# EAGLE design at88g.v1 (EAGLE 4.11)
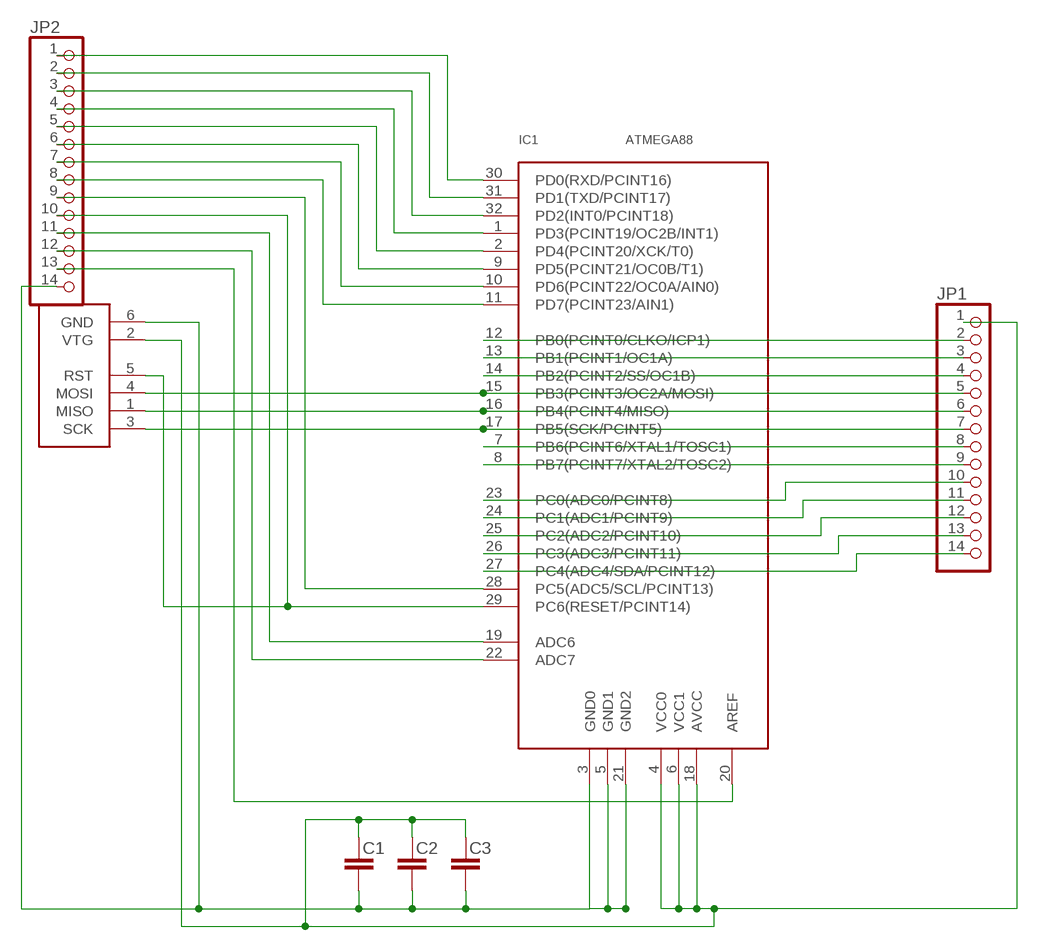
[diagram p0: schematic, sheet 1]

## Parts
C1  C-EU  [C0603]
C2  C-EU  [C0603]
C3  C-EU  [C0603]
IC1  ATMEGA88  [TQFP32]
JP1  PINHD-1X14  [1X14]
JP2  PINHD-1X14  [1X14]
X1  AVRISP6PIN  [6PIN]

## Nets
GND0: C1.2 C2.2 C3.2 IC1.3(GND0) IC1.5(GND1) IC1.21(GND2) JP2.14 X1.6(GND)
N$1: IC1.29(PC6(RESET/PCINT14)) JP2.10 X1.5(RST)
N$2: IC1.15(PB3(PCINT3/OC2A/MOSI)) JP1.5 X1.4(MOSI)
N$3: IC1.16(PB4(PCINT4/MISO)) JP1.6 X1.1(MISO)
N$4: IC1.17(PB5(SCK/PCINT5)) JP1.7 X1.3(SCK)
N$5: IC1.30(PD0(RXD/PCINT16)) JP2.1
N$6: IC1.31(PD1(TXD/PCINT17)) JP2.2
N$7: IC1.32(PD2(INT0/PCINT18)) JP2.3
N$8: IC1.1(PD3(PCINT19/OC2B/INT1)) JP2.4
N$9: IC1.2(PD4(PCINT20/XCK/T0)) JP2.5
N$10: IC1.9(PD5(PCINT21/OC0B/T1)) JP2.6
N$11: IC1.10(PD6(PCINT22/OC0A/AIN0)) JP2.7
N$12: IC1.11(PD7(PCINT23/AIN1)) JP2.8
N$13: IC1.12(PB0(PCINT0/CLKO/ICP1)) JP1.2
N$14: IC1.13(PB1(PCINT1/OC1A)) JP1.3
N$15: IC1.14(PB2(PCINT2/SS/OC1B)) JP1.4
N$16: IC1.7(PB6(PCINT6/XTAL1/TOSC1)) JP1.8
N$17: IC1.8(PB7(PCINT7/XTAL2/TOSC2)) JP1.9
N$18: IC1.23(PC0(ADC0/PCINT8)) JP1.10
N$19: IC1.24(PC1(ADC1/PCINT9)) JP1.11
N$20: IC1.25(PC2(ADC2/PCINT10)) JP1.12
N$21: IC1.26(PC3(ADC3/PCINT11)) JP1.13
N$22: IC1.27(PC4(ADC4/SDA/PCINT12)) JP1.14
N$23: IC1.28(PC5(ADC5/SCL/PCINT13)) JP2.9
N$24: IC1.19(ADC6) JP2.11
N$25: IC1.22(ADC7) JP2.12
N$26: IC1.20(AREF) JP2.13
VCC0: C1.1 C2.1 C3.1 IC1.4(VCC0) IC1.6(VCC1) IC1.18(AVCC) JP1.1 X1.2(VTG)

## Library data of the parts
C1-C3 = rcl:C-EU
IC1 = atmega88:ATMEGA88
JP1 JP2 = pinhead-mm:PINHD-1X14
X1 = avrisp:AVRISP6PIN

## Board
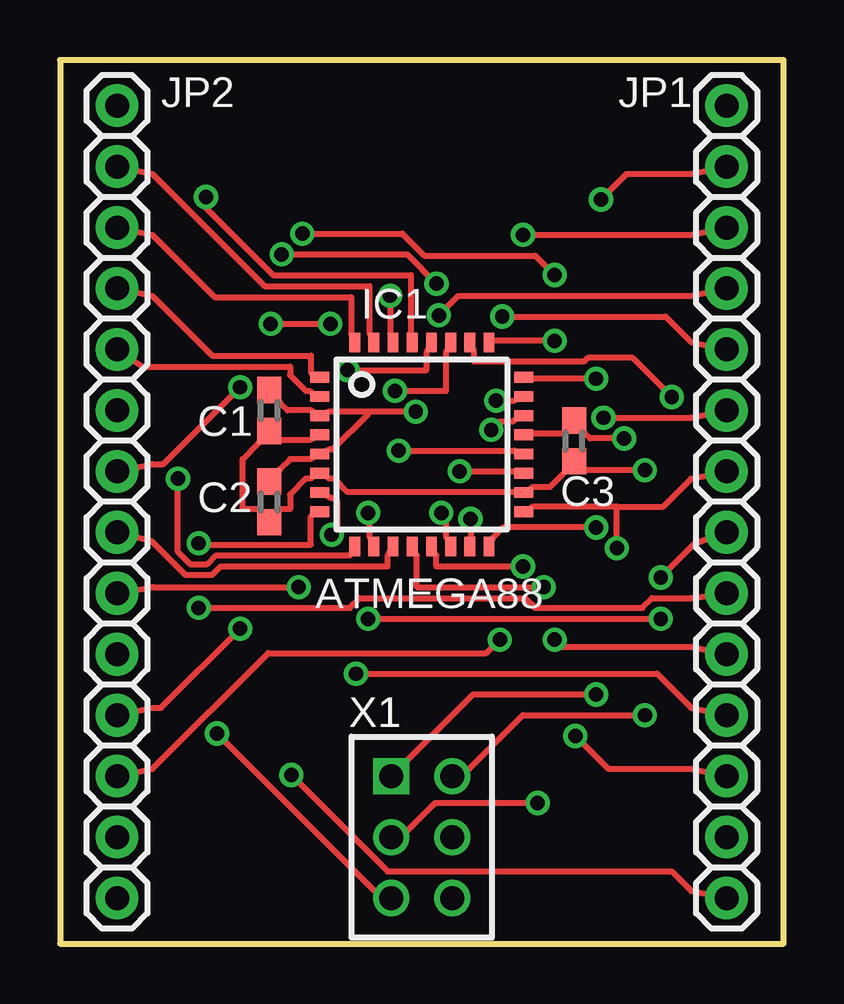
[diagram p1: board, top side]
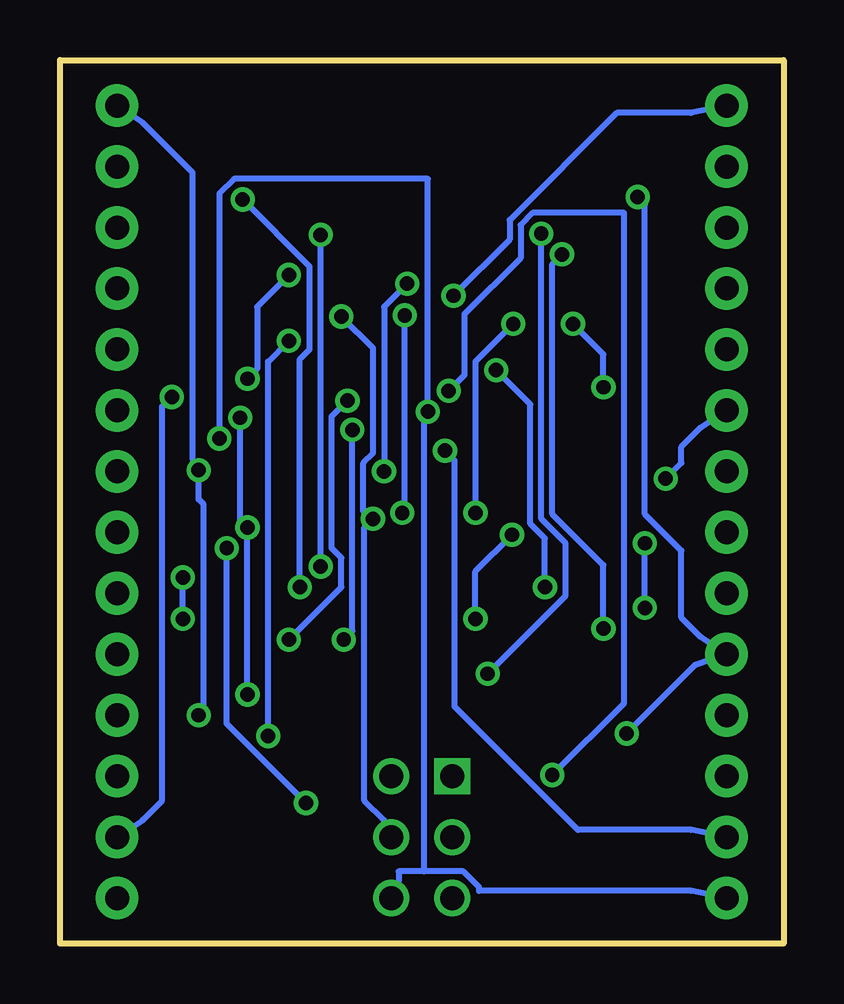
[diagram p2: board, bottom side, seen from below]

Size 30.15 x 36.82 mm. Coordinates in mm from the lower left corner, seen from the top.
Outline: 0,0 30.15,0 30.15,36.82 0,36.82 0,0
Copper layers (1*16): Top 0.035mm / dielectric 1.5mm / Bottom 0.035mm
Design rules "default": minimum track width 10mil, minimum drill 0.6mm, track to track 8mil, track to pad 8mil, pad to pad 8mil, via to via 8mil, smd to smd 8mil, copper to edge 40mil, drill to drill 8mil, minimum pad ring 10mil, minimum via ring 8mil, stop-mask expansion 4mil, vias tented up to drill 0mil, thermal gap 10mil

### Footprints (pad centres in the part's own frame; a part is rotated, then mirrored left to right if it is on the bottom)
C0603 = smd 1.1 x 1: 1 -0.85,0; 2 0.85,0
TQFP32 = smd 0.8 x 0.45: 1 -4.25,2.65; 2 -4.25,1.85; 3 -4.25,1.05; 4 -4.25,0.25; 5 -4.25,-0.55; 6 -4.25,-1.35; 7 -4.25,-2.15; 8 -4.25,-2.95; 17 4.25,-2.95; 18 4.25,-2.15; 19 4.25,-1.35; 20 4.25,-0.55; 21 4.25,0.25; 22 4.25,1.05; 23 4.25,1.85; 24 4.25,2.65 | smd 0.45 x 0.8: 9 -2.8,-4.4; 10 -2,-4.4; 11 -1.2,-4.4; 12 -0.4,-4.4; 13 0.4,-4.4; 14 1.2,-4.4; 15 2,-4.4; 16 2.8,-4.4; 25 2.8,4.1; 26 2,4.1; 27 1.2,4.1; 28 0.4,4.1; 29 -0.4,4.1; 30 -1.2,4.1; 31 -2,4.1; 32 -2.8,4.1
1X14 = drill 1 pad 1.778 round: 1 -16.51,0; 2 -13.97,0; 3 -11.43,0; 4 -8.89,0; 5 -6.35,0; 6 -3.81,0; 7 -1.27,0; 8 1.27,0; 9 3.81,0; 10 6.35,0; 11 8.89,0; 12 11.43,0; 13 13.97,0; 14 16.51,0
6PIN = drill 1 square: 1 -1.27,2.54 | drill 1 round: 2 1.27,2.54; 3 -1.27,0; 4 1.27,0; 5 -1.27,-2.54; 6 1.27,-2.54

### Placement (x,y rotation side)
C1  8.72,22.22 90 top
C2  8.72,18.41 90 top
C3  21.43,20.95 90 top
IC1  15.08,20.95 0 top
JP1  27.78,18.41 270 top
JP2  2.38,18.41 270 top
X1  15.08,4.44 0 top

### Tracks (layer width: path | path; a pad name or v marks a point on that pad's centre or on a via)
GND0  (via drill 0.6)
  Top 0.254: C2.2 9.18,19.78 9.59,20.19 10.45,20.19 IC1.5 11.21,20.59 11.37,20.59 12.84,22.07 12.84,22.17 | IC1.21 19.7,21.26 20.97,21.26 C3.2 21.88,21.26 22.09,21.05 v23.51,21.05 | C1.2 9.18,22.53 9.49,22.22 10.45,22.22 IC1.3 11.21,22.17 12.84,22.17 | v14.82,22.17 12.84,22.17
  Bottom 0.254: 14.97,3.02 16.04,3.02 16.04,2.61 X1.6 | 14.97,3.02 13.35,3.02 12.69,2.36 12.69,2.21 3.85,2.21 JP2.14 | v23.51,21.05 23.51,31.26 22.9,31.87 14.82,31.87 v14.82,22.17 14.97,21.71 14.97,3.02
N$1  (via drill 0.6)
  Top 0.254: v6.08,31.11 6.08,30.65 8.88,27.86 14.62,27.86 14.62,25.42 IC1.29 | v6.54,8.76 13.09,2.21 X1.5
  Bottom 0.254: v6.08,31.11 5.78,30.81 5.78,17.9 4.26,16.38 4.26,13.58 3.44,12.77 JP2.10 3.7,11.6 v6.54,8.76
N$2  (via drill 0.6)
  Top 0.254: v17.11,17.7 17.11,16.94 IC1.15 | v18.43,26.13 25.24,26.13 26.3,25.06 JP1.5
  Bottom 0.254: X1.4 16.65,5.15 17.46,5.96 17.46,17.34 v17.11,17.7 17.51,18 17.51,20.04 17.11,20.44 17.11,24.81 v18.43,26.13
N$3  (via drill 0.6)
  Top 0.254: v22.34,17.34 18.48,17.34 18.07,16.94 IC1.16 | v22.64,21.92 26.3,21.92 JP1.6 | v22.34,10.38 17.21,10.38 X1.1
  Bottom 0.254: v22.64,21.92 22.64,17.65 v22.34,17.34 v22.34,10.38
N$4  (via drill 0.6)
  Top 0.254: 23.2,18.21 25.13,18.21 26.3,19.38 JP1.7 | 23.2,18.21 19.7,18.21 IC1.17 | v19.9,5.86 15.63,5.86 14.52,4.75 X1.3 | v23.2,16.48 23.2,18.21
  Bottom 0.254: v19.9,5.86 23.2,9.16 v23.2,16.48
N$5  (via drill 0.6)
  Top 0.254: v13.75,27 13.75,25.42 IC1.30
  Bottom 0.254: v13.75,27 11.42,29.33 11.42,30.14 6.95,34.62 3.85,34.62 JP2.1
N$6
  Top 0.254: IC1.31 12.89,25.42 12.89,27.4 8.52,27.4 3.85,32.08 JP2.2
N$7
  Top 0.254: IC1.32 12.13,25.42 12.13,26.94 6.44,26.94 3.85,29.53 JP2.3
N$8
  Top 0.254: IC1.1 10.45,23.8 10.45,24.51 6.34,24.51 3.85,27 JP2.4
N$9
  Top 0.254: IC1.2 10.45,22.98 10.4,23.03 10.25,23.03 9.59,23.69 9.59,24.05 3.44,24.05 JP2.5
N$10  (via drill 0.6)
  Top 0.254: v4.91,19.38 4.91,16.33 5.42,15.82 6.13,15.82 6.49,16.18 12.08,16.18 IC1.9
  Bottom 0.254: v4.91,19.38 4.26,20.04 4.26,20.7 3.44,21.51 JP2.6
N$11  (via drill 0.6)
  Top 0.254: v12.84,17.95 12.89,17.95 12.89,16.94 IC1.10 | v8.78,25.83 v11.26,25.83 | v7.51,23.19 4.3,19.98 3.85,19.98 JP2.7
  Bottom 0.254: v12.84,17.95 12.84,24.25 v11.26,25.83 | v8.78,25.83 7.51,24.56 v7.51,23.19
N$12
  Top 0.254: IC1.11 13.65,16.18 13.65,15.72 6.69,15.72 6.34,15.36 5.22,15.36 3.8,16.78 JP2.8
N$13  (via drill 0.6)
  Top 0.254: v20.16,14.85 14.87,14.85 14.87,16.18 IC1.12 | v22.54,31.01 23.61,32.08 26.3,32.08 JP1.2
  Bottom 0.254: v20.16,14.85 20.16,24.35 19.75,24.76 19.75,28.21 v22.54,31.01
N$14  (via drill 0.6)
  Top 0.254: v19.29,15.72 15.69,15.72 15.69,16.18 IC1.13 | v19.29,29.53 26.3,29.53 JP1.3
  Bottom 0.254: v19.29,15.72 v19.29,29.53
N$15  (via drill 0.6)
  Top 0.254: v15.89,17.95 16.09,17.95 16.09,16.94 IC1.14 | v15.79,26.18 16.6,27 26.3,27 JP1.4
  Bottom 0.254: v15.89,17.95 15.79,18.05 v15.79,26.18
N$16  (via drill 0.6)
  Top 0.254: v11.32,17.04 11.57,17.04 11.57,18.41 11.42,18.56 11.26,18.56 11.21,18.61 IC1.7 | v12.84,13.53 v25.03,13.53 | v25.03,15.26 26.45,16.68 JP1.8
  Bottom 0.254: v11.32,17.04 12.84,15.51 v12.84,13.53 | v25.03,13.53 v25.03,15.26
N$17  (via drill 0.6)
  Top 0.254: v5.78,16.68 5.83,16.63 10.45,16.63 10.45,17.8 IC1.8 | v5.78,13.99 12.08,13.99 12.48,14.4 19.39,14.4 19.8,13.99 24.27,13.99 24.68,14.4 26.3,14.4 JP1.9
  Bottom 0.254: v5.78,13.99 v5.78,16.68
N$18  (via drill 0.6)
  Top 0.254: v18.17,22.63 18.94,22.63 IC1.23 | v20.61,12.67 20.92,12.37 26.3,12.37 JP1.10
  Bottom 0.254: v18.17,22.63 18.83,21.97 18.83,16.48 18.43,16.07 18.43,14.85 v20.61,12.67
N$19  (via drill 0.6)
  Top 0.254: v22.34,23.54 19.7,23.54 IC1.24 | v20.61,27.86 19.8,28.67 15.18,28.67 14.26,29.59 v10.1,29.59 | v12.33,11.25 24.88,11.25 26.3,9.83 JP1.11
  Bottom 0.254: v22.34,23.54 21.93,23.95 21.93,26.54 v20.61,27.86 | v10.1,29.59 10.1,17.7 9.08,16.68 9.08,14.5 v12.33,11.25
N$20  (via drill 0.6)
  Top 0.254: v20.61,25.12 18.07,25.12 IC1.25 | v21.48,8.66 22.85,7.29 26.3,7.29 JP1.12
  Bottom 0.254: v20.61,25.12 21.48,24.25 v21.48,8.66
N$21  (via drill 0.6)
  Top 0.254: v25.49,22.78 23.86,24.4 21.98,24.4 21.83,24.25 17.26,24.25 17.26,24.66 IC1.26
  Bottom 0.254: v25.49,22.78 25.89,22.37 25.89,5.96 26.71,5.15 JP1.13
N$22  (via drill 0.6)
  Top 0.254: v13.96,23.03 16.09,23.03 16.09,24.66 IC1.27 | v9.64,7.03 13.65,3.02 25.49,3.02 26.3,2.21 JP1.14
  Bottom 0.254: v13.96,23.03 13.3,23.69 13.3,26.23 10.96,28.57 10.96,29.94 10.45,30.45 6.64,30.45 6.64,10.03 v9.64,7.03
N$23  (via drill 0.6)
  Top 0.254: v11.98,23.9 15.28,23.9 15.28,24.66 IC1.28 | v9.94,14.85 3.85,14.85 JP2.9
  Bottom 0.254: v11.98,23.9 10.55,22.47 10.55,17.5 9.94,16.89 v9.94,14.85
N$24  (via drill 0.6)
  Top 0.254: v16.65,19.68 18.94,19.68 IC1.19 | v15.69,27.5 14.46,28.72 v9.23,28.72 | v7.51,13.13 4.2,9.83 3.85,9.83 JP2.11
  Bottom 0.254: v16.65,19.68 16.65,26.54 v15.69,27.5 | v9.23,28.72 9.64,28.32 9.64,17.9 7.51,15.77 v7.51,13.13
N$25  (via drill 0.6)
  Top 0.254: v17.97,21.41 18.33,21.76 18.89,21.76 18.94,21.81 IC1.22 | v18.33,12.67 17.77,12.11 8.67,12.11 3.85,7.29 JP2.12
  Bottom 0.254: v17.97,21.41 17.97,13.03 v18.33,12.67
N$26  (via drill 0.6)
  Top 0.254: v14.11,20.54 18.94,20.54 IC1.20
  Bottom 0.254: v14.11,20.54 13.7,20.14 13.7,9.88 8.57,4.75 3.85,4.75 JP2.13
VCC0  (via drill 0.6)
  Top 0.254: IC1.4 10.45,21 9.18,21 C1.1 8.27,20.85 7.61,20.19 7.61,18.11 8.27,18.11 C2.1 9.18,18.11 9.59,18.11 9.59,18.72 10.25,19.38 10.45,19.38 IC1.6 11.21,19.38 11.42,19.38 11.98,18.82 18.94,18.82 IC1.18 19.7,19.02 20.41,19.02 20.97,19.58 C3.1 21.88,19.73 v24.37,19.73 | v24.37,9.52 19.29,9.52 17.06,7.29 X1.2
  Bottom 0.254: v24.37,9.52 24.17,9.72 24.17,18.31 24.37,18.51 v24.37,19.73 24.62,20.19 24.62,32.13 26.71,34.21 JP1.1